# EAGLE design M632X (EAGLE 6.6.0)
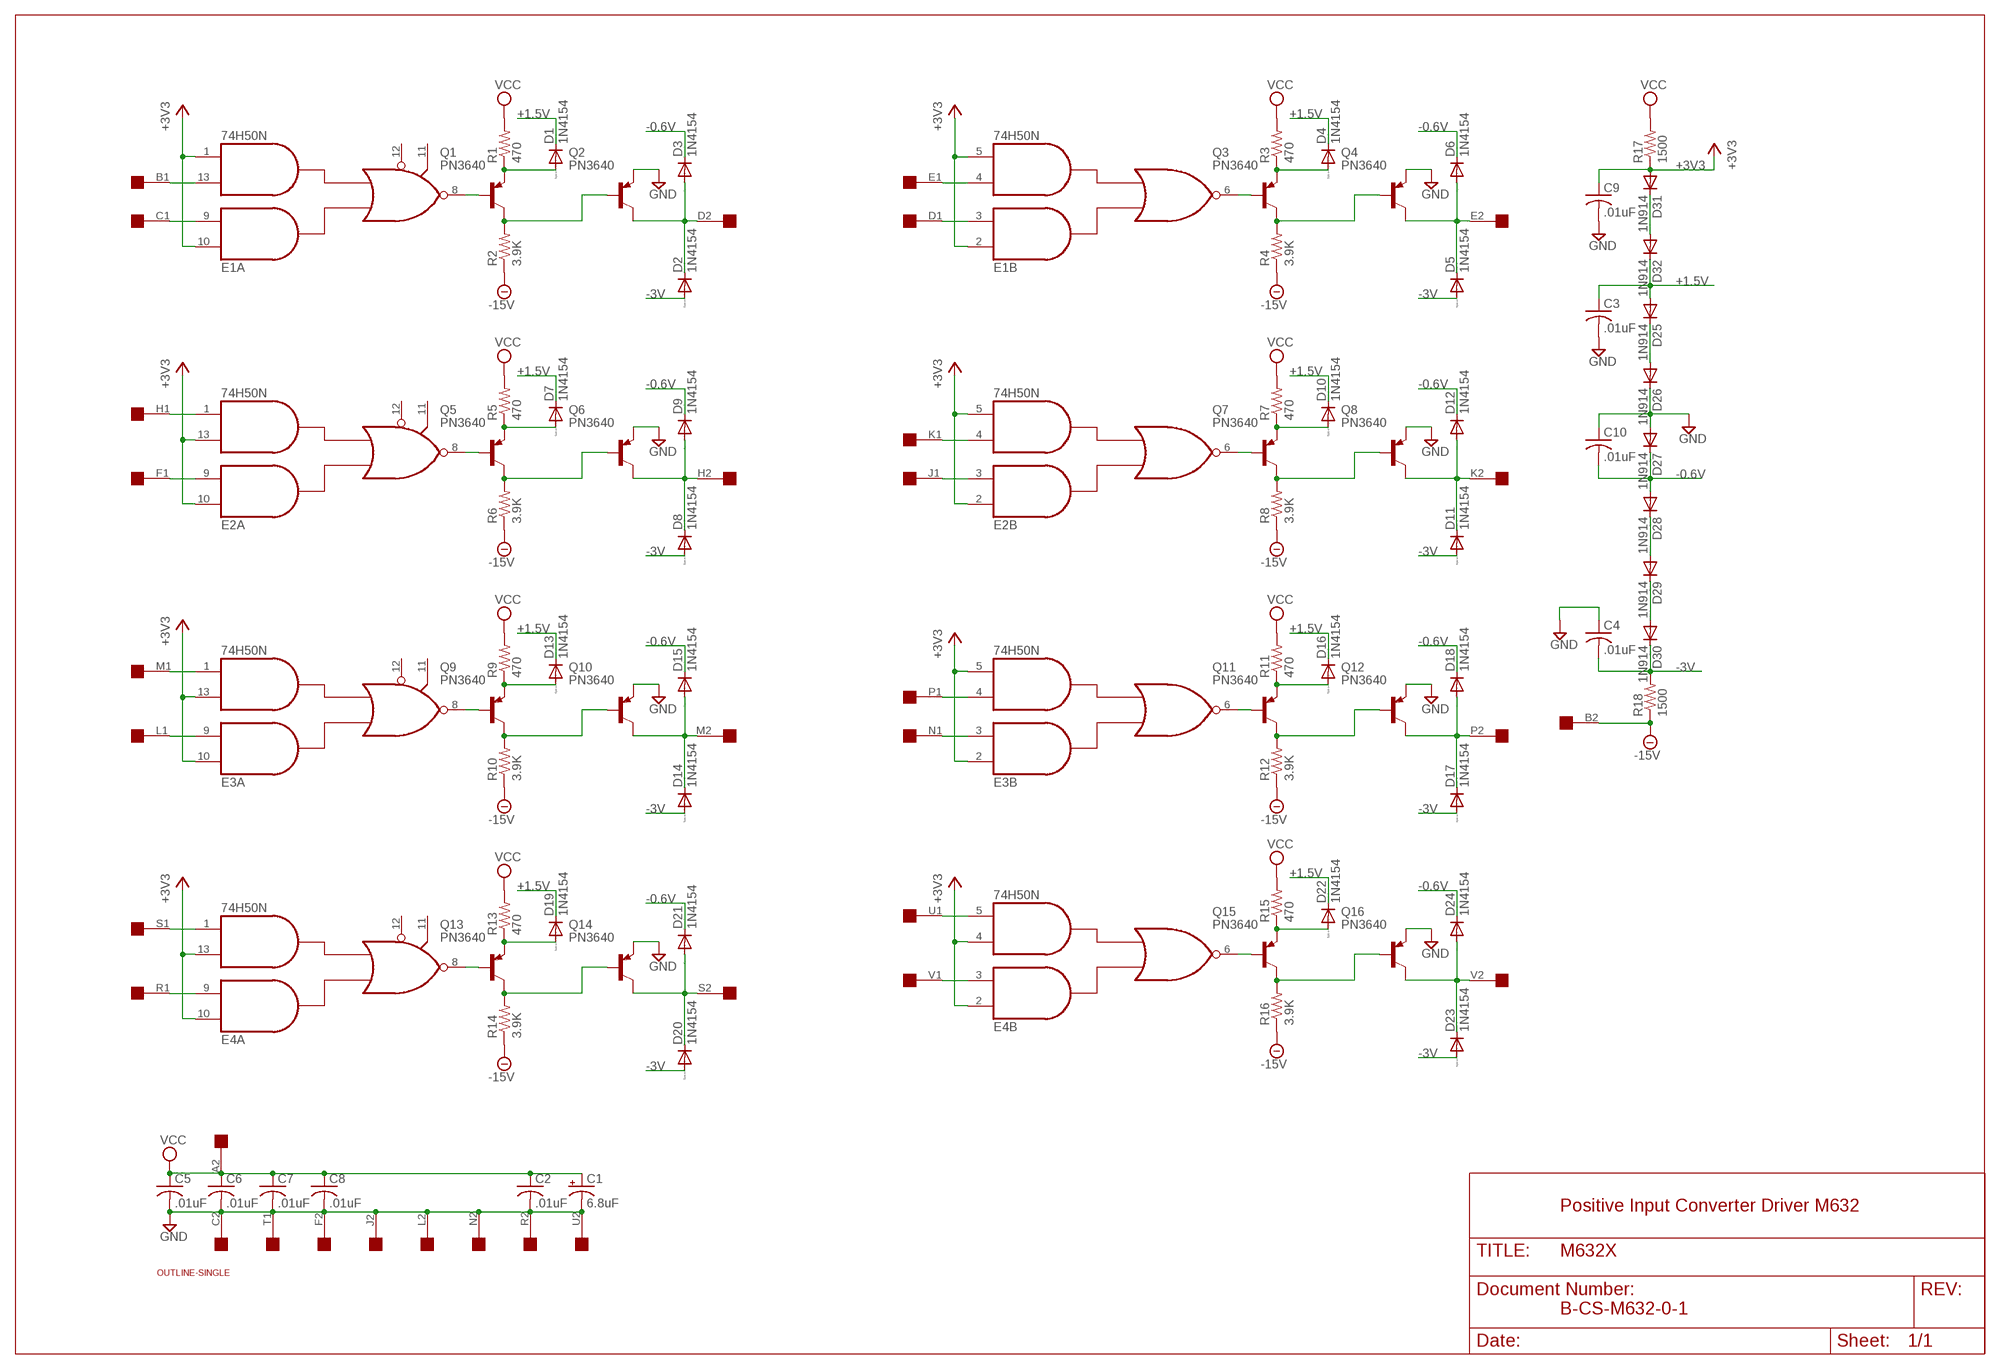
[diagram p0: schematic, sheet 1]

## Parts
C1  6.8uF  CPOL-USE20-8AXIAL  [E12-8]
C2  .01uF  C-US050-025X075  [C050-025X075]
C3  .01uF  C-US050-025X075  [C050-025X075]
C4  .01uF  C-US050-025X075  [C050-025X075]
C5  .01uF  C-US050-025X075  [C050-025X075]
C6  .01uF  C-US050-025X075  [C050-025X075]
C7  .01uF  C-US050-025X075  [C050-025X075]
C8  .01uF  C-US050-025X075  [C050-025X075]
C9  .01uF  C-US050-025X075  [C050-025X075]
C10  .01uF  C-US050-025X075  [C050-025X075]
D1  1N4154  1N4148DO35-10  [DO35-10]
D2  1N4154  1N4148DO35-10  [DO35-10]
D3  1N4154  1N4148DO35-10  [DO35-10]
D4  1N4154  1N4148DO35-10  [DO35-10]
D5  1N4154  1N4148DO35-10  [DO35-10]
D6  1N4154  1N4148DO35-10  [DO35-10]
D7  1N4154  1N4148DO35-10  [DO35-10]
D8  1N4154  1N4148DO35-10  [DO35-10]
D9  1N4154  1N4148DO35-10  [DO35-10]
D10  1N4154  1N4148DO35-10  [DO35-10]
D11  1N4154  1N4148DO35-10  [DO35-10]
D12  1N4154  1N4148DO35-10  [DO35-10]
D13  1N4154  1N4148DO35-10  [DO35-10]
D14  1N4154  1N4148DO35-10  [DO35-10]
D15  1N4154  1N4148DO35-10  [DO35-10]
D16  1N4154  1N4148DO35-10  [DO35-10]
D17  1N4154  1N4148DO35-10  [DO35-10]
D18  1N4154  1N4148DO35-10  [DO35-10]
D19  1N4154  1N4148DO35-10  [DO35-10]
D20  1N4154  1N4148DO35-10  [DO35-10]
D21  1N4154  1N4148DO35-10  [DO35-10]
D22  1N4154  1N4148DO35-10  [DO35-10]
D23  1N4154  1N4148DO35-10  [DO35-10]
D24  1N4154  1N4148DO35-10  [DO35-10]
D25  1N914  1N4148DO35-10  [DO35-10]
D26  1N914  1N4148DO35-10  [DO35-10]
D27  1N914  1N4148DO35-10  [DO35-10]
D28  1N914  1N4148DO35-10  [DO35-10]
D29  1N914  1N4148DO35-10  [DO35-10]
D30  1N914  1N4148DO35-10  [DO35-10]
D31  1N914  1N4148DO35-10  [DO35-10]
D32  1N914  1N4148DO35-10  [DO35-10]
E1  74H50N  7450N  [DIL14]
E2  74H50N  7450N  [DIL14]
E3  74H50N  7450N  [DIL14]
E4  74H50N  7450N  [DIL14]
Q1  PN3640  2N2904  [TO39]
Q2  PN3640  2N2904  [TO39]
Q3  PN3640  2N2904  [TO39]
Q4  PN3640  2N2904  [TO39]
Q5  PN3640  2N2904  [TO39]
Q6  PN3640  2N2904  [TO39]
Q7  PN3640  2N2904  [TO39]
Q8  PN3640  2N2904  [TO39]
Q9  PN3640  2N2904  [TO39]
Q10  PN3640  2N2904  [TO39]
Q11  PN3640  2N2904  [TO39]
Q12  PN3640  2N2904  [TO39]
Q13  PN3640  2N2904  [TO39]
Q14  PN3640  2N2904  [TO39]
Q15  PN3640  2N2904  [TO39]
Q16  PN3640  2N2904  [TO39]
R1  470  R-US_0207/10  [0207/10]
R2  3.9K  R-US_0207/10  [0207/10]
R3  470  R-US_0207/10  [0207/10]
R4  3.9K  R-US_0207/10  [0207/10]
R5  470  R-US_0207/10  [0207/10]
R6  3.9K  R-US_0207/10  [0207/10]
R7  470  R-US_0207/10  [0207/10]
R8  3.9K  R-US_0207/10  [0207/10]
R9  470  R-US_0207/10  [0207/10]
R10  3.9K  R-US_0207/10  [0207/10]
R11  470  R-US_0207/10  [0207/10]
R12  3.9K  R-US_0207/10  [0207/10]
R13  470  R-US_0207/10  [0207/10]
R14  3.9K  R-US_0207/10  [0207/10]
R15  470  R-US_0207/10  [0207/10]
R16  3.9K  R-US_0207/10  [0207/10]
R17  1500  R-US_0207/10  [0207/10]
R18  1500  R-US_0207/10  [0207/10]
U$1  SINGLE  [EDGE-CON2]
U$4  OUTLINE-SINGLE  [SINGLE]

## Nets
+1.5V: C3.1 D1.C D4.C D7.C D10.C D13.C D16.C D19.C D22.C D25.A D32.C
+3V3 [Supply]: C9.1 D31.A E1.1(A:I4) E1.2(B:I1) E1.5(B:I4) E1.10(A:I1) E2.2(B:I1) E2.5(B:I4) E2.10(A:I1) E2.13(A:I3) E3.2(B:I1) E3.5(B:I4) E3.10(A:I1) E3.13(A:I3) E4.2(B:I1) E4.4(B:I3) E4.10(A:I1) E4.13(A:I3) R17.1
-0.6V: C10.2 D3.C D6.C D9.C D12.C D15.C D18.C D21.C D24.C D27.C D28.A
-3V: C4.2 D2.A D5.A D8.A D11.A D14.A D17.A D20.A D23.A D30.C R18.2
-15V: R2.1 R4.1 R6.1 R8.1 R10.1 R12.1 R14.1 R16.1 R18.1 U$1.B2
GND [Supply]: C1.- C2.2 C3.2 C4.1 C5.2 C6.2 C7.2 C8.2 C9.2 C10.1 D26.C D27.A Q2.1(E) Q4.1(E) Q6.1(E) Q8.1(E) Q10.1(E) Q12.1(E) Q14.1(E) Q16.1(E) U$1.C2 U$1.F2 U$1.J2 U$1.L2 U$1.N2 U$1.R2 U$1.T1 U$1.U2
N$1: E2.3(B:I2) U$1.J1
N$2: E2.4(B:I3) U$1.K1
N$3: E1.9(A:I2) U$1.C1
N$4: E1.13(A:I3) U$1.B1
N$5: E4.1(A:I4) U$1.S1
N$6: E4.9(A:I2) U$1.R1
N$7: E1.8(A:O) Q1.2(B)
N$8: Q1.3(C) Q2.2(B) R2.2
N$9: E2.8(A:O) Q5.2(B)
N$10: D7.A Q5.1(E) R5.1
N$11: D2.C D3.A Q2.3(C) U$1.D2
N$12: Q5.3(C) Q6.2(B) R6.2
N$13: D8.C D9.A Q6.3(C) U$1.H2
N$14: E4.3(B:I2) U$1.V1
N$15: E4.5(B:I4) U$1.U1
N$16: E3.1(A:I4) U$1.M1
N$17: E3.9(A:I2) U$1.L1
N$18: E3.8(A:O) Q9.2(B)
N$19: D13.A Q9.1(E) R9.1
N$20: Q9.3(C) Q10.2(B) R10.2
N$21: D14.C D15.A Q10.3(C) U$1.M2
N$22: E4.8(A:O) Q13.2(B)
N$23: D19.A Q13.1(E) R13.1
N$24: Q13.3(C) Q14.2(B) R14.2
N$25: D20.C D21.A Q14.3(C) U$1.S2
N$26: E1.6(B:O) Q3.2(B)
N$27: D4.A Q3.1(E) R3.1
N$28: Q3.3(C) Q4.2(B) R4.2
N$29: E1.4(B:I3) U$1.E1
N$30: E1.3(B:I2) U$1.D1
N$31: D5.C D6.A Q4.3(C) U$1.E2
N$32: E2.6(B:O) Q7.2(B)
N$33: E2.1(A:I4) U$1.H1
N$34: E3.3(B:I2) U$1.N1
N$35: E3.4(B:I3) U$1.P1
N$36: E2.9(A:I2) U$1.F1
N$37: D10.A Q7.1(E) R7.1
N$38: Q7.3(C) Q8.2(B) R8.2
N$39: D11.C D12.A Q8.3(C) U$1.K2
N$40: E3.6(B:O) Q11.2(B)
N$41: D1.A Q1.1(E) R1.1
N$42: D16.A Q11.1(E) R11.1
N$43: Q11.3(C) Q12.2(B) R12.2
N$44: D17.C D18.A Q12.3(C) U$1.P2
N$45: E4.6(B:O) Q15.2(B)
N$46: D22.A Q15.1(E) R15.1
N$47: Q15.3(C) Q16.2(B) R16.2
N$48: D23.C D24.A Q16.3(C) U$1.V2
N$50: D25.C D26.A
N$51: D28.C D29.A
N$52: D31.C D32.A
N$53: D29.C D30.A
VCC [Supply]: C1.+ C2.1 C5.1 C6.1 C7.1 C8.1 R1.2 R3.2 R5.2 R7.2 R9.2 R11.2 R13.2 R15.2 R17.2 U$1.A2
Unconnected: E1.11(A:I6) E1.12(A:I5) E2.11(A:I6) E2.12(A:I5) E3.11(A:I6) E3.12(A:I5) E4.11(A:I6) E4.12(A:I5) U$1.A1 U$1.T2

## Notes on the sheet
- Positive Input Converter Driver M632
- B-CS-M632-0-1

## Power pins joined to a net without a drawn wire
GND: E1.7(P:GND) E2.7(P:GND) E3.7(P:GND) E4.7(P:GND)
VCC: E1.14(P:VCC) E2.14(P:VCC) E3.14(P:VCC) E4.14(P:VCC)

## Library data of the parts
C1 = dec-con:CPOL-USE20-8AXIAL: A 0.8 inch electrolytic.
C2-C10 = rcl:C-US: CAPACITOR, American symbol
D1-D32 = diode:1N4148: DIODE high speed (Philips)
E1-E4 = dec-con:74*50: 4-2-3-2 input AND OR INVERTER gates
Q1-Q16 = transistor-pnp:2N2904*: PNP Transistror
R1-R18 = rcl:R-US_: RESISTOR, American symbol
U$1 = dec-con:SINGLE: Single-Height DEC board
U$4 = dec-con:OUTLINE-*: Board outlines for DEC boards.

## Net classes
1 Supply: width 0.813 mm

## Board
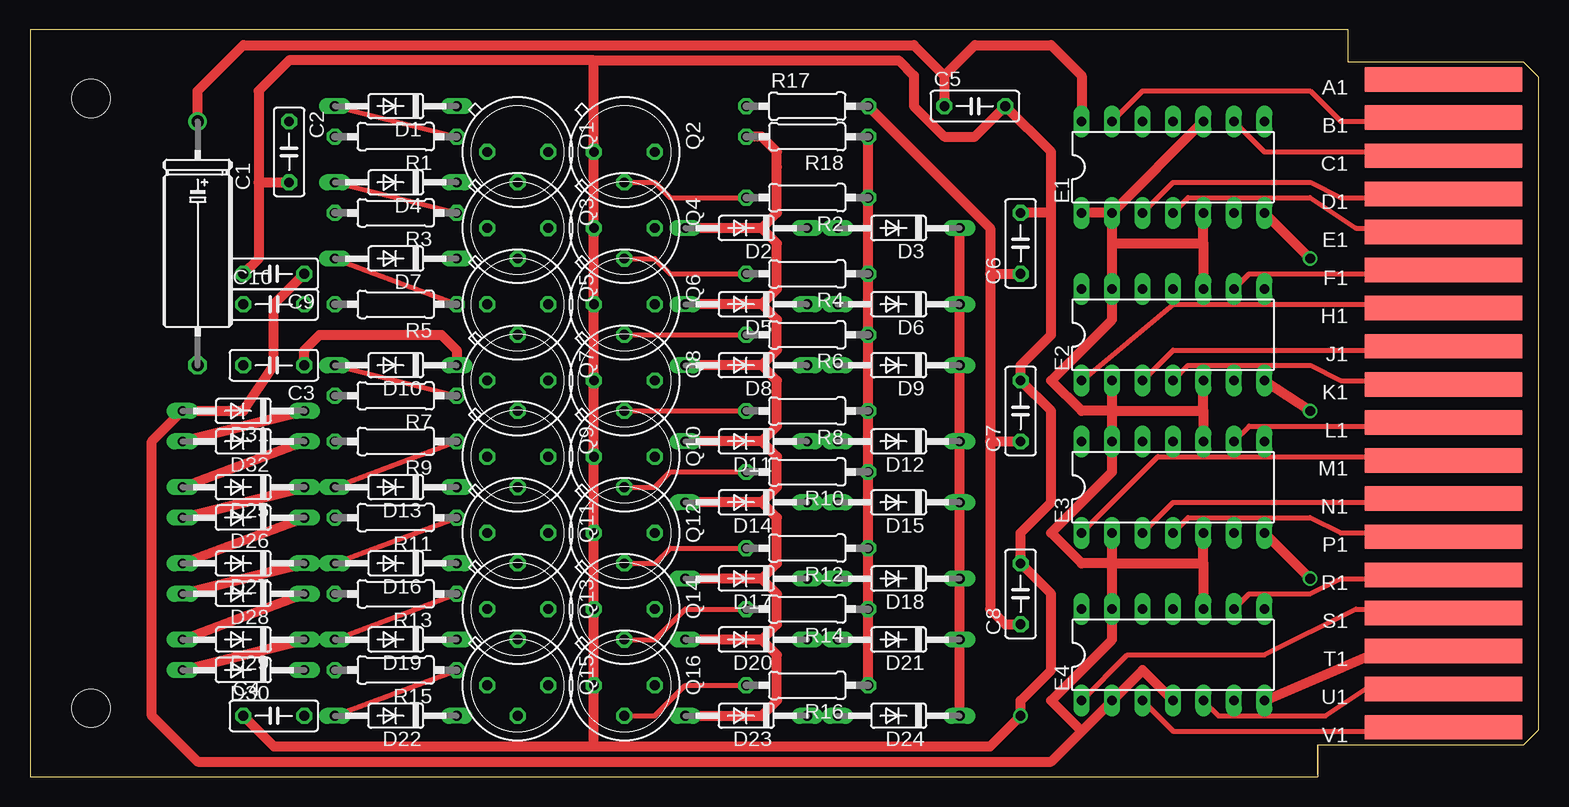
[diagram p1: board, top side]
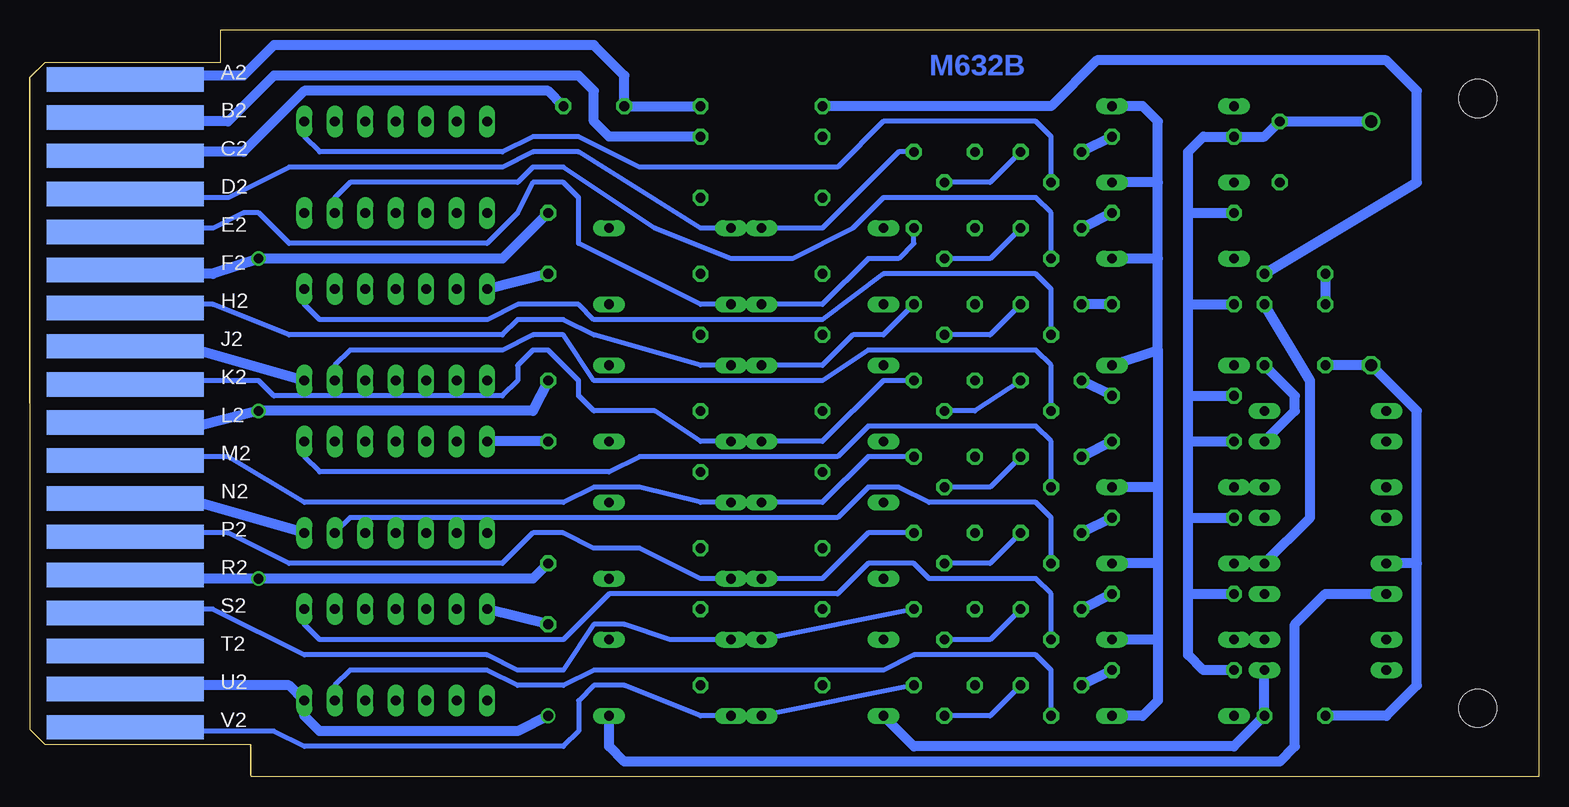
[diagram p2: board, bottom side, seen from below]

Size 125.73 x 62.23 mm. Coordinates in mm from the lower left corner, seen from the top.
Copper layers (1+16): Top 0.035mm / dielectric 1.5mm / Bottom 0.035mm
Design rules "16mils": minimum track width 16mil, minimum drill 32mil, track to track 15mil, track to pad 10mil, pad to pad 10mil, via to via 10mil, smd to smd 10mil, copper to edge 13mil, drill to drill 10mil, minimum pad ring 10mil, minimum via ring 8mil, stop-mask expansion 0mil, vias tented up to drill 0mil, thermal gap 10mil

### Footprints (pad centres in the part's own frame; a part is rotated, then mirrored left to right if it is on the bottom)
E12-8 = drill 1.016: + -10.16,0 | drill 1.016 octagon: - 10.16,0
C050-025X075 = drill 0.813 octagon: 1 -2.54,0; 2 2.54,0
DO35-10 = drill 0.813 long: A 5.08,0; C -5.08,0
DIL14 = drill 0.813 long: 1 -7.62,-3.81; 2 -5.08,-3.81; 3 -2.54,-3.81; 4 0,-3.81; 5 2.54,-3.81; 6 5.08,-3.81; 7 7.62,-3.81; 8 7.62,3.81; 9 5.08,3.81; 10 2.54,3.81; 11 0,3.81; 12 -2.54,3.81; 13 -5.08,3.81; 14 -7.62,3.81
TO39 = drill 0.813 octagon: 1 0,-2.54; 2 2.54,0; 3 0,2.54
0207/10 = drill 0.813 octagon: 1 -5.08,0; 2 5.08,0
EDGE-CON2 = smd 13.106 x 2.032: A1 7.938,4.128; B1 7.938,7.303; C1 7.938,10.477; D1 7.938,13.652; E1 7.938,16.828; F1 7.938,20.003; H1 7.938,23.177; J1 7.938,26.352; K1 7.938,29.527; L1 7.938,32.703; M1 7.938,35.877; N1 7.938,39.053; P1 7.938,42.227; R1 7.938,45.403; S1 7.938,48.578; T1 7.938,51.752; U1 7.938,54.928; V1 7.938,58.102 | smd 13.106 x 2.032 bottom: A2 7.938,4.128; B2 7.938,7.303; C2 7.938,10.477; D2 7.938,13.652; E2 7.938,16.828; F2 7.938,20.003; H2 7.938,23.177; J2 7.938,26.352; K2 7.938,29.527; L2 7.938,32.703; M2 7.938,35.877; N2 7.938,39.053; P2 7.938,42.227; R2 7.938,45.403; S2 7.938,48.578; T2 7.938,51.752; U2 7.938,54.928; V2 7.938,58.102
SINGLE = hole 3.175: 120.65,56.515; 120.65,5.715

### Placement (x,y rotation side)
C1  13.97,44.45 270 top
C2  21.59,52.07 270 top
C3  20.32,34.29 180 top
C4  20.32,5.08 0 top
C5  78.74,55.88 0 top
C6  82.55,44.45 90 top
C7  82.55,30.48 90 top
C8  82.55,15.24 90 top
C9  20.32,41.91 180 top
C10  20.32,39.37 0 top
D1  30.48,55.88 180 top
D2  59.69,45.72 180 top
D3  72.39,45.72 180 top
D4  30.48,49.53 180 top
D5  59.69,39.37 180 top
D6  72.39,39.37 180 top
D7  30.48,43.18 180 top
D8  59.69,34.29 180 top
D9  72.39,34.29 180 top
D10  30.48,34.29 180 top
D11  59.69,27.94 180 top
D12  72.39,27.94 180 top
D13  30.48,24.13 180 top
D14  59.69,22.86 180 top
D15  72.39,22.86 180 top
D16  30.48,17.78 180 top
D17  59.69,16.51 180 top
D18  72.39,16.51 180 top
D19  30.48,11.43 180 top
D20  59.69,11.43 180 top
D21  72.39,11.43 180 top
D22  30.48,5.08 180 top
D23  59.69,5.08 180 top
D24  72.39,5.08 180 top
D25  17.78,24.13 180 top
D26  17.78,21.59 180 top
D27  17.78,17.78 180 top
D28  17.78,15.24 180 top
D29  17.78,11.43 180 top
D30  17.78,8.89 180 top
D31  17.78,30.48 180 top
D32  17.78,27.94 180 top
E1  95.25,50.8 0 top
E2  95.25,36.83 0 top
E3  95.25,24.13 0 top
E4  95.25,10.16 0 top
Q1  40.64,52.07 270 top
Q2  49.53,52.07 270 top
Q3  40.64,45.72 270 top
Q4  49.53,45.72 270 top
Q5  40.64,39.37 270 top
Q6  49.53,39.37 270 top
Q7  40.64,33.02 270 top
Q8  49.53,33.02 270 top
Q9  40.64,26.67 270 top
Q10  49.53,26.67 270 top
Q11  40.64,20.32 270 top
Q12  49.53,20.32 270 top
Q13  40.64,13.97 270 top
Q14  49.53,13.97 270 top
Q15  40.64,7.62 270 top
Q16  49.53,7.62 270 top
R1  30.48,53.34 180 top
R2  64.77,48.26 180 top
R3  30.48,46.99 180 top
R4  64.77,41.91 180 top
R5  30.48,39.37 180 top
R6  64.77,36.83 180 top
R7  30.48,31.75 180 top
R8  64.77,30.48 180 top
R9  30.48,27.94 180 top
R10  64.77,25.4 180 top
R11  30.48,21.59 180 top
R12  64.77,19.05 180 top
R13  30.48,15.24 180 top
R14  64.77,13.97 180 top
R15  30.48,8.89 180 top
R16  64.77,7.62 180 top
R17  64.77,55.88 0 top
R18  64.77,53.34 180 top
U$1  125.73,62.23 180 top
U$4  125.73,62.23 180 top

### Tracks (layer width: path | path; a pad name or v marks a point on that pad's centre or on a via)
+1.5V
  Top 0.813: D25.A D32.C | C3.1 22.86,35.56 24.13,36.83 34.29,36.83 35.56,35.56 D10.C
  Bottom 0.813: D22.C 33.02,5.08 31.75,6.35 31.75,11.43 | 31.75,17.78 31.75,11.43 | 31.75,24.13 31.75,17.78 | 31.75,35.56 31.75,24.13 | 31.75,35.56 31.75,43.18 | 31.75,43.18 31.75,49.53 | 31.75,49.53 31.75,54.61 33.02,55.88 D1.C | 31.75,49.53 D4.C | 31.75,43.18 D7.C | D10.C 31.75,35.56 | 31.75,24.13 D13.C | 31.75,17.78 D16.C | 31.75,11.43 D19.C | C3.1 20.32,31.75 20.32,30.48 D32.C
+3V3
  Top 0.813: 87.63,3.81 85.09,1.27 13.97,1.27 10.16,5.08 10.16,27.94 D31.A 17.78,30.48 20.32,34.29 20.32,39.37 C9.1 | 87.63,3.81 E4.2 92.71,8.89 E4.4 | 97.79,44.45 E2.10 | 97.79,44.45 E1.5 | 97.79,17.78 E4.10 | 97.79,17.78 E3.5 | 90.17,17.78 E4.13 90.17,11.43 85.09,6.35 87.63,3.81 | 90.17,17.78 E3.2 | 90.17,44.45 E1.2 | 90.17,44.45 E2.13 90.17,38.1 85.09,33.02 87.63,30.48 90.17,30.48 | 90.17,44.45 97.79,44.45 | 90.17,17.78 97.79,17.78 | 97.79,30.48 E3.10 | 97.79,30.48 E2.5 | 90.17,30.48 E3.13 90.17,25.4 85.09,20.32 87.63,17.78 90.17,17.78 | 90.17,30.48 E2.2 | 90.17,30.48 97.79,30.48 | E1.2 E1.1 | E1.2 E1.10
  Bottom 0.813: R17.1 40.64,55.88 36.83,59.69 12.7,59.69 10.16,57.15 10.16,49.53 C9.1
-0.6V
  Top 0.813: D3.C D6.C D9.C D12.C D15.C D18.C D21.C D24.C | D28.A D27.C
  Bottom 0.813: D27.C 19.05,21.59 19.05,33.02 C10.2 | D24.C 77.47,2.54 76.2,1.27 21.59,1.27 20.32,2.54 20.32,12.7 17.78,15.24 D28.A
-3V
  Top 0.813: D23.A 60.96,5.08 62.23,6.35 62.23,10.16 60.96,11.43 | 60.96,11.43 62.23,12.7 62.23,15.24 60.96,16.51 | 60.96,16.51 62.23,17.78 62.23,21.59 60.96,22.86 | 60.96,22.86 62.23,24.13 62.23,26.67 60.96,27.94 | 60.96,27.94 62.23,29.21 62.23,33.02 60.96,34.29 | 60.96,34.29 62.23,35.56 62.23,38.1 60.96,39.37 | 60.96,39.37 62.23,40.64 62.23,44.45 60.96,45.72 | 60.96,45.72 D2.A | 60.96,39.37 D5.A | 60.96,34.29 D8.A | 60.96,27.94 D11.A | 60.96,22.86 D14.A | 60.96,11.43 D20.A | 60.96,16.51 D17.A | 60.96,45.72 62.23,46.99 62.23,50.8 62.23,52.07 60.96,53.34 R18.2
  Bottom 0.813: D30.C C4.2 25.4,2.54 52.07,2.54 D23.A
-15V
  Top 0.813: R16.1 R14.1 R12.1 R10.1 R8.1 R6.1 R4.1 R2.1 R18.1
  Bottom 0.813: U$1.B2 117.13,54.9 116.84,54.61 109.22,54.61 105.41,58.42 80.01,58.42 78.74,57.15 78.74,54.61 77.47,53.34 R18.1
GND  (via drill 0.81)
  Top 0.813: D27.A D26.C | 46.99,59.69 72.39,59.69 73.66,58.42 73.66,55.88 76.2,53.34 78.74,53.34 C5.2 85.09,52.07 85.09,46.99 | 46.99,59.69 Q2.1 Q4.1 Q6.1 Q8.1 Q10.1 Q12.1 Q14.1 Q16.1 46.99,2.54 | C9.2 19.05,43.18 19.05,49.53 | 19.05,49.53 C2.2 | 19.05,49.53 19.05,57.15 21.59,59.69 46.99,59.69 | C4.1 20.32,2.54 46.99,2.54 | 46.99,2.54 80.01,2.54 v82.55,5.08 82.55,6.35 85.09,8.89 85.09,15.24 C8.2 82.55,20.32 85.09,22.86 85.09,30.48 C7.2 82.55,34.29 85.09,36.83 85.09,46.99 | 85.09,46.99 C6.2 | v106.68,30.48 E2.7 | v106.68,43.18 E1.7 | v106.68,16.51 E3.7 | U$1.T1 116.84,10.16 111.76,10.16 E4.7
  Bottom 0.813: U$1.C2 117.17,51.74 116.84,52.07 107.95,52.07 102.87,57.15 82.55,57.15 C5.2 | U$1.U2 116.84,7.62 104.14,7.62 E4.7 102.87,5.08 101.6,3.81 85.09,3.81 v82.55,5.08 | U$1.N2 116.84,22.86 111.76,22.86 E3.7 | U$1.R2 116.84,16.51 v106.68,16.51 83.82,16.51 C8.2 | U$1.L2 116.84,29.21 111.76,29.21 v106.68,30.48 83.82,30.48 C7.2 | C6.2 86.36,43.18 v106.68,43.18 110.49,41.91 116.84,41.91 U$1.F2 | C3.2 C1.- 10.16,30.48 10.16,17.78 | C9.2 C10.1 | 10.16,17.78 D27.A | C4.1 12.7,5.08 10.16,7.62 10.16,17.78 | U$1.J2 116.84,35.56 111.76,35.56 E2.7
N$1
  Top 0.406: U$1.J1 116.84,35.56 95.25,35.56 E2.3
N$2
  Top 0.406: U$1.K1 116.84,33.02 109.22,33.02 106.68,34.29 96.52,34.29 E2.4
N$3
  Top 0.406: U$1.C1 116.84,52.07 102.87,52.07 E1.9
N$4
  Top 0.406: U$1.B1 116.84,54.61 109.22,54.61 106.68,57.15 92.71,57.15 E1.13
N$5
  Top 0.406: U$1.S1 116.84,13.97 110.49,13.97 102.87,10.16 91.44,10.16 E4.1
N$6
  Top 0.406: E4.9 101.6,15.24 106.68,15.24 109.22,16.51 116.84,16.51 U$1.R1
N$7
  Bottom 0.406: E1.8 102.87,53.34 101.6,52.07 86.36,52.07 83.82,53.34 80.01,53.34 74.93,50.8 58.42,50.8 54.61,54.61 41.91,54.61 40.64,53.34 Q1.2
N$8
  Top 0.406: Q2.2 52.07,49.53 53.34,48.26 R2.2
  Bottom 0.406: Q1.3 45.72,49.53 Q2.2
N$9
  Bottom 0.406: Q5.2 40.64,40.64 41.91,41.91 54.61,41.91 59.69,38.1 78.74,38.1 80.01,39.37 85.09,39.37 87.63,38.1 101.6,38.1 102.87,39.37 E2.8
N$10
  Top 0.406: D7.A R5.1
  Bottom 0.813: R5.1 Q5.1
N$11
  Bottom 0.406: U$1.D2 116.84,48.26 109.22,48.26 104.14,50.8 86.36,50.8 83.82,52.07 80.01,52.07 69.85,45.72 D3.A D2.C 59.69,45.72 53.34,52.07 Q2.3
N$12
  Top 0.406: Q6.2 R6.2
  Bottom 0.406: Q5.3 45.72,36.83 Q6.2
N$13
  Bottom 0.406: U$1.H2 116.84,39.37 110.49,39.37 104.14,36.83 86.36,36.83 85.09,38.1 81.28,38.1 78.74,36.83 69.85,34.29 D9.A D8.C 59.69,34.29 57.15,36.83 54.61,36.83 Q6.3
N$14
  Top 0.406: U$1.V1 116.84,3.81 95.25,3.81 E4.3
N$15
  Top 0.406: U$1.U1 116.84,7.62 111.76,7.62 107.95,5.08 99.06,5.08 E4.5
N$16
  Top 0.406: U$1.M1 115.57,26.67 93.98,26.67 E3.1
N$17
  Top 0.406: U$1.L1 116.84,29.21 101.6,29.21 E3.9
N$18
  Bottom 0.406: Q9.2 40.64,27.94 41.91,29.21 55.88,29.21 58.42,26.67 74.93,26.67 77.47,25.4 101.6,25.4 102.87,26.67 E3.8
N$19
  Top 0.406: D13.A R9.1
  Bottom 0.813: R9.1 Q9.1
N$20
  Top 0.406: Q10.2 52.07,24.13 53.34,25.4 R10.2
  Bottom 0.406: Q9.3 45.72,24.13 Q10.2
N$21
  Bottom 0.406: Q10.3 55.88,26.67 59.69,22.86 D14.C D15.A 69.85,22.86 74.93,24.13 78.74,24.13 81.28,22.86 102.87,22.86 109.22,26.67 116.84,26.67 U$1.M2
N$22
  Bottom 0.406: Q13.2 40.64,15.24 41.91,16.51 50.8,16.51 52.07,17.78 55.88,17.78 58.42,15.24 77.47,15.24 81.28,11.43 101.6,11.43 102.87,12.7 E4.8
N$23
  Top 0.406: D19.A R13.1
  Bottom 0.813: R13.1 Q13.1
N$24
  Top 0.406: Q14.2 52.07,11.43 54.61,13.97 R14.2
  Bottom 0.406: Q13.3 45.72,11.43 Q14.2
N$25
  Bottom 0.406: U$1.S2 116.84,13.97 110.49,13.97 102.87,10.16 87.63,10.16 85.09,8.89 81.28,8.89 78.74,12.7 76.2,12.7 72.39,11.43 D21.A D20.C Q14.3
N$26
  Bottom 0.406: E1.6 100.33,48.26 99.06,49.53 85.09,49.53 83.82,50.8 81.28,50.8 73.66,45.72 67.31,43.18 62.23,43.18 57.15,45.72 54.61,48.26 41.91,48.26 40.64,46.99 Q3.2
N$27
  Top 0.406: D4.A R3.1
  Bottom 0.813: R3.1 Q3.1
N$28
  Top 0.406: Q4.2 52.07,43.18 53.34,41.91 R4.2
  Bottom 0.406: Q3.3 45.72,43.18 Q4.2
N$29
  Top 0.406: U$1.E1 116.84,45.72 110.49,45.72 106.68,48.26 96.52,48.26 E1.4
N$30
  Top 0.406: U$1.D1 116.84,48.26 109.22,48.26 106.68,49.53 95.25,49.53 E1.3
N$31
  Bottom 0.406: U$1.E2 116.84,45.72 110.49,45.72 107.95,46.99 106.68,46.99 104.14,44.45 87.63,44.45 85.09,46.99 83.82,49.53 81.28,49.53 80.01,48.26 80.01,44.45 69.85,39.37 D6.A D5.C 59.69,39.37 55.88,43.18 53.34,43.18 52.07,44.45 Q4.3
N$32
  Bottom 0.406: Q7.2 40.64,34.29 41.91,35.56 55.88,35.56 59.69,33.02 78.74,33.02 81.28,36.83 83.82,36.83 86.36,35.56 99.06,35.56 100.33,34.29 E2.6
N$33
  Top 0.406: U$1.H1 116.84,39.37 95.25,39.37 E2.1
N$34
  Top 0.406: U$1.N1 116.84,22.86 95.25,22.86 E3.3
N$35
  Top 0.406: U$1.P1 116.84,20.32 109.22,20.32 106.68,21.59 96.52,21.59 E3.4
N$36
  Top 0.406: U$1.F1 116.84,41.91 101.6,41.91 E2.9
N$37
  Top 0.406: D10.A R7.1
  Bottom 0.813: R7.1 Q7.1
N$38
  Top 0.406: Q8.2 R8.2
  Bottom 0.406: Q7.3 46.99,30.48 Q8.2
N$39
  Bottom 0.406: Q8.3 54.61,33.02 59.69,27.94 D11.C D12.A 69.85,27.94 73.66,30.48 78.74,30.48 80.01,31.75 80.01,33.02 82.55,35.56 83.82,35.56 85.09,34.29 85.09,33.02 86.36,31.75 105.41,31.75 106.68,33.02 116.84,33.02 U$1.K2
N$40
  Bottom 0.406: Q11.2 40.64,21.59 41.91,22.86 50.8,22.86 53.34,24.13 55.88,24.13 58.42,21.59 99.06,21.59 E3.6
N$41
  Top 0.406: D1.A R1.1
  Bottom 0.813: R1.1 Q1.1
N$42
  Top 0.406: D16.A R11.1
  Bottom 0.813: R11.1 Q11.1
N$43
  Top 0.406: Q12.2 52.07,17.78 53.34,19.05 R12.2
  Bottom 0.406: Q11.3 45.72,17.78 Q12.2
N$44
  Bottom 0.406: Q12.3 55.88,20.32 59.69,16.51 D17.C D18.A 69.85,16.51 74.93,19.05 78.74,19.05 81.28,20.32 83.82,20.32 86.36,17.78 104.14,17.78 109.22,20.32 116.84,20.32 U$1.P2
N$45
  Bottom 0.406: Q15.2 40.64,8.89 41.91,10.16 52.07,10.16 54.61,8.89 78.74,8.89 81.28,7.62 85.09,7.62 87.63,8.89 99.06,8.89 100.33,7.62 E4.6
N$46
  Top 0.406: D22.A R15.1
  Bottom 0.813: R15.1 Q15.1
N$47
  Top 0.406: Q16.2 52.07,5.08 54.61,7.62 R16.2
  Bottom 0.406: Q16.2 45.72,5.08 Q15.3
N$48
  Bottom 0.406: U$1.V2 116.84,3.81 105.41,3.81 102.87,2.54 81.28,2.54 80.01,3.81 80.01,6.35 78.74,7.62 76.2,7.62 69.85,5.08 D24.A D23.C Q16.3
N$50
  Top 0.813: D26.A D25.C
N$51
  Top 0.813: D29.A D28.C
N$52
  Top 0.813: D32.A D31.C
N$53
  Top 0.813: D30.A D29.C
VCC
  Top 0.813: 76.2,58.42 C5.1 | 76.2,58.42 73.66,60.96 17.78,60.96 13.97,57.15 C1.+ | 76.2,58.42 78.74,60.96 85.09,60.96 87.63,58.42 E1.14 | C8.1 81.28,12.7 80.01,13.97 80.01,27.94 | 80.01,41.91 80.01,45.72 R17.2 | 80.01,41.91 80.01,27.94 | 80.01,41.91 C6.1 | 80.01,27.94 C7.1
  Bottom 0.813: U$1.A2 117.24,58.02 116.84,58.42 107.95,58.42 105.41,60.96 78.74,60.96 76.2,58.42 C5.1 R17.2 | R15.2 27.94,8.89 29.21,10.16 29.21,15.24 | 29.21,15.24 29.21,21.59 | 29.21,21.59 29.21,27.94 | 29.21,27.94 29.21,31.75 | 29.21,31.75 29.21,39.37 | 29.21,39.37 29.21,46.99 | 29.21,46.99 29.21,52.07 27.94,53.34 R1.2 22.86,53.34 C2.1 C1.+ | 29.21,46.99 R3.2 | 29.21,39.37 R5.2 | 29.21,31.75 R7.2 | 29.21,27.94 R9.2 | 29.21,15.24 R13.2 | 29.21,21.59 R11.2 | C8.1 E4.14 | C7.1 E3.14 | C6.1 E2.14

### Text on the board
Bottom: M632B